# EAGLE design Flashing 2 LEDS (EAGLE 9.6.2)
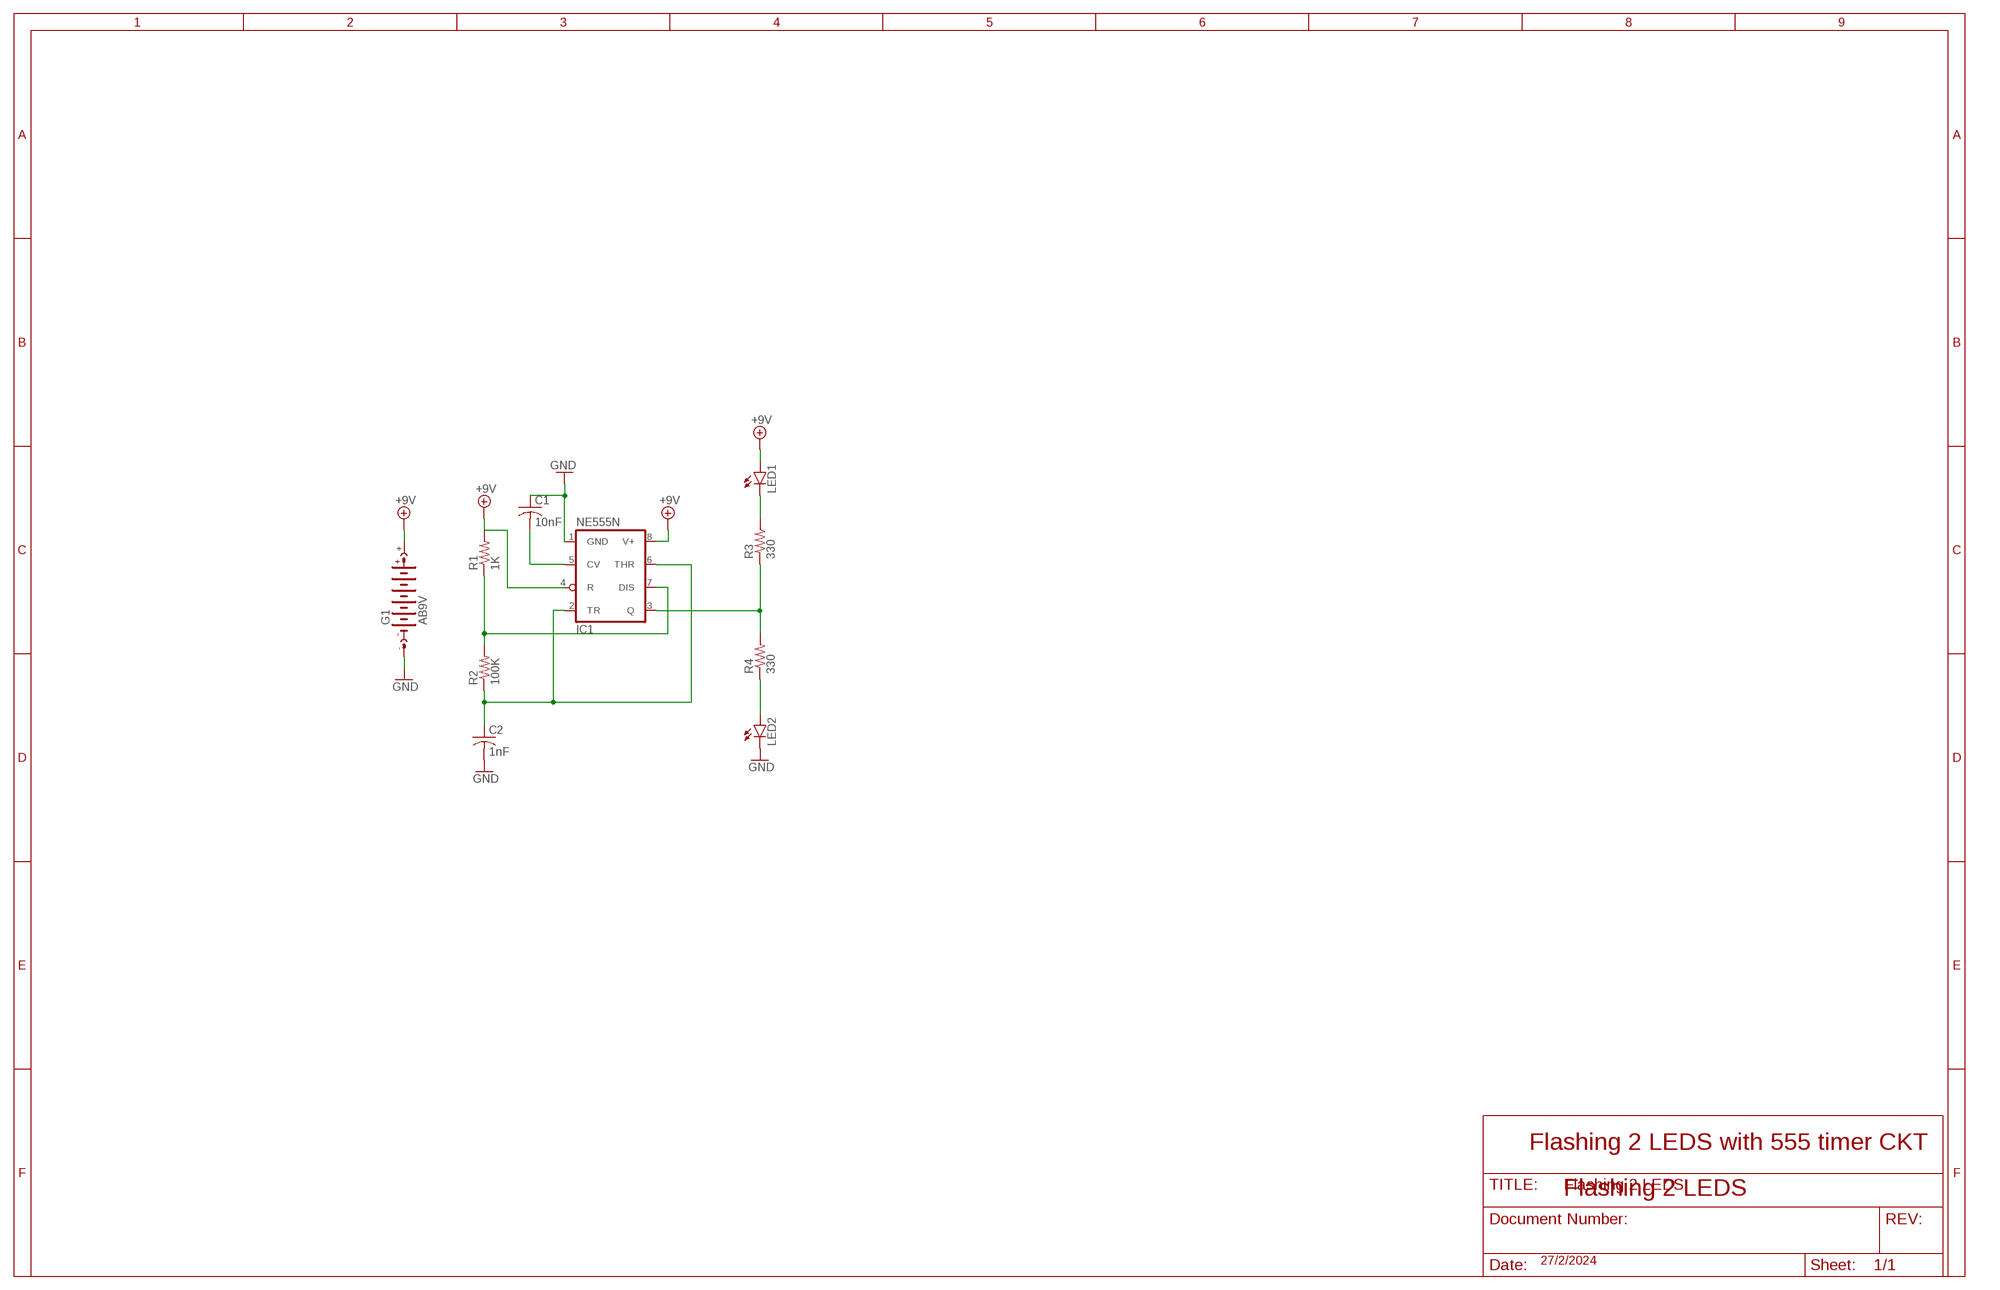
[diagram p0: schematic, sheet 1]

## Parts
C1  10nF  C-USC1206  [C1206]
C2  1nF  C-USC1206  [C1206]
G1  AB9V  [AB9V]
IC1  NE555N  [DIL08]
LED1  LED5MM  [LED5MM]
LED2  LED5MM  [LED5MM]
R1  1K  R-US_R0603  [R0603]
R2  100K  R-US_R0603  [R0603]
R3  330  R-US_R0603  [R0603]
R4  330  R-US_R0603  [R0603]

## Nets
+9V: G1.+ IC1.4(R) IC1.8(V+) LED1.A R1.2
GND: C1.1 C2.2 G1.- IC1.1(GND) LED2.K(C)
N$1: IC1.7(DIS) R1.1 R2.2
N$2: C2.1 IC1.2(TR) IC1.6(THR) R2.1
N$3: LED1.K(C) R3.2
N$4: IC1.3(Q) R3.1 R4.2
N$5: LED2.A R4.1
N$6: C1.2 IC1.5(CV)

## Notes on the sheet
- Flashing 2 LEDS with 555 timer CKT
- Flashing 2 LEDS
- 27/2/2024

## Library data of the parts
C1 C2 = rcl:C-US: CAPACITOR, American symbol; SPICEPREFIX: C
G1 = battery:AB9V: 9-V BATTERY CLIP
IC1 = linear:*555: TIMER
LED1 LED2 = led:LED: LED OSRAM: - CHIPLED LG R971, LG N971, LY N971, LG Q971, LY Q971, LO R971, LY R971 LH N974, LH R974 LS Q976, LO Q976, LY Q976 LO Q996 - Hyper CHIPLED LW Q18S LB Q993, LB Q99A, LB R99A - SideLED LS A670, LO A670, LY A670, LG A670, LP A670 LB A673, LV A673, LT A673, LW A673 LH A674 LY A675 LS A676, LA A676, LO A676, LY A676, LW A676 LS A679, LY A679, LG A679 - Hyper Micro SIDELED® LS Y876, LA Y876, LO Y876, LY Y876 LT Y87S - SmartLED LW L88C, LW L88S LB L89C, LB L89S, LG L890 LS L89K, LO L89K, LY L89K LS L896, LA L896, LO L896, LY L896 - TOPLED LS T670, LO T670, LY T670, LG T670, LP T670 LSG T670, LSP T670, LSY T670, LOP T670, LYG T670 LG T671, LOG T671, LSG T671 LB T673, LV T673, LT T673, LW T673 LH T674 LS T676, LA T676, LO T676, LY T676, LB T676, LH T676, LSB T676, LW T676 LB T67C, LV T67C, LT T67C, LS T67K, LO T67K, LY T67K, LW E67C LS E67B, LA E67B, LO E67B, LY E67B, LB E67C, LV E67C, LT E67C LW T67C LS T679, LY T679, LG T679 LS T770, LO T770, LY T770, LG T770, LP T770 LB T773, LV T773, LT T773, LW T773 LH T774 LS E675, LA E675, LY E675, LS T675 LS T776, LA T776, LO T776, LY T776, LB T776 LHGB T686 LT T68C, LB T68C - Hyper Mini TOPLED® LB M676 - Mini TOPLED Santana® LG M470 LS M47K, LO M47K, LY M47K Source: http://www.osram.convergy.de LUXEON: - LUMILED® LXK2-PW12-R00, LXK2-PW12-S00, LXK2-PW14-U00, LXK2-PW14-V00 LXK2-PM12-R00, LXK2-PM12-S00, LXK2-PM14-U00 LXK2-PE12-Q00, LXK2-PE12-R00, LXK2-PE12-S00, LXK2-PE14-T00, LXK2-PE14-U00 LXK2-PB12-K00, LXK2-PB12-L00, LXK2-PB12-M00, LXK2-PB14-N00, LXK2-PB14-P00, LXK2-PB14-Q00 LXK2-PR12-L00, LXK2-PR12-M00, LXK2-PR14-Q00, LXK2-PR14-R00 LXK2-PD12-Q00, LXK2-PD12-R00, LXK2-PD12-S00 LXK2-PH12-R00, LXK2-PH12-S00 LXK2-PL12-P00, LXK2-PL12-Q00, LXK2-PL12-R00 Source: www.luxeon.com KINGBRIGHT: KA-3528ASYC Source: www.kingbright.com
R1-R4 = rcl:R-US_: RESISTOR, American symbol; SPICEPREFIX: R

## Board
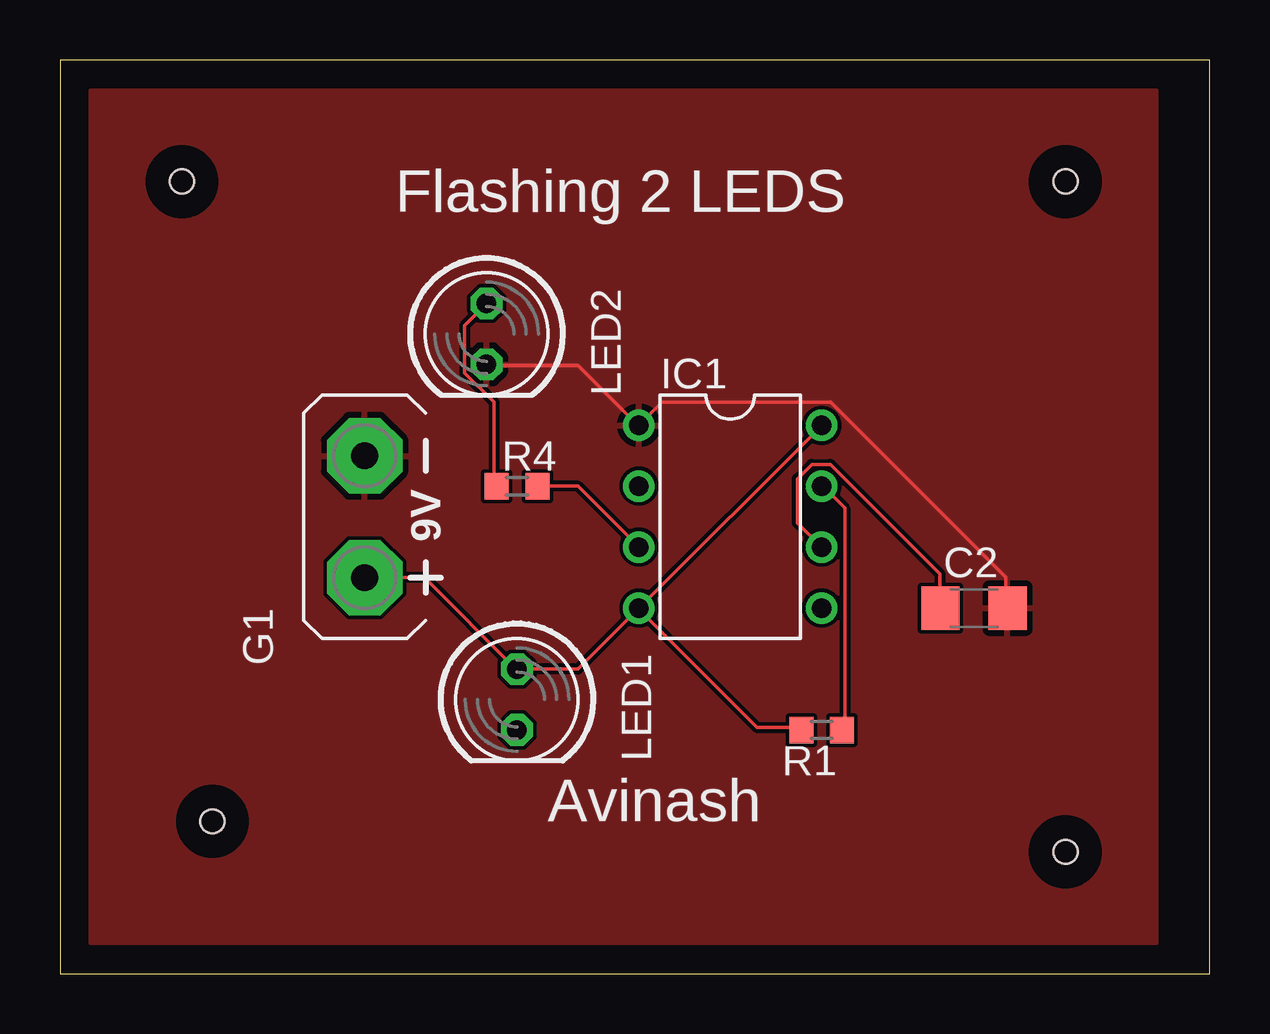
[diagram p1: board, top side]
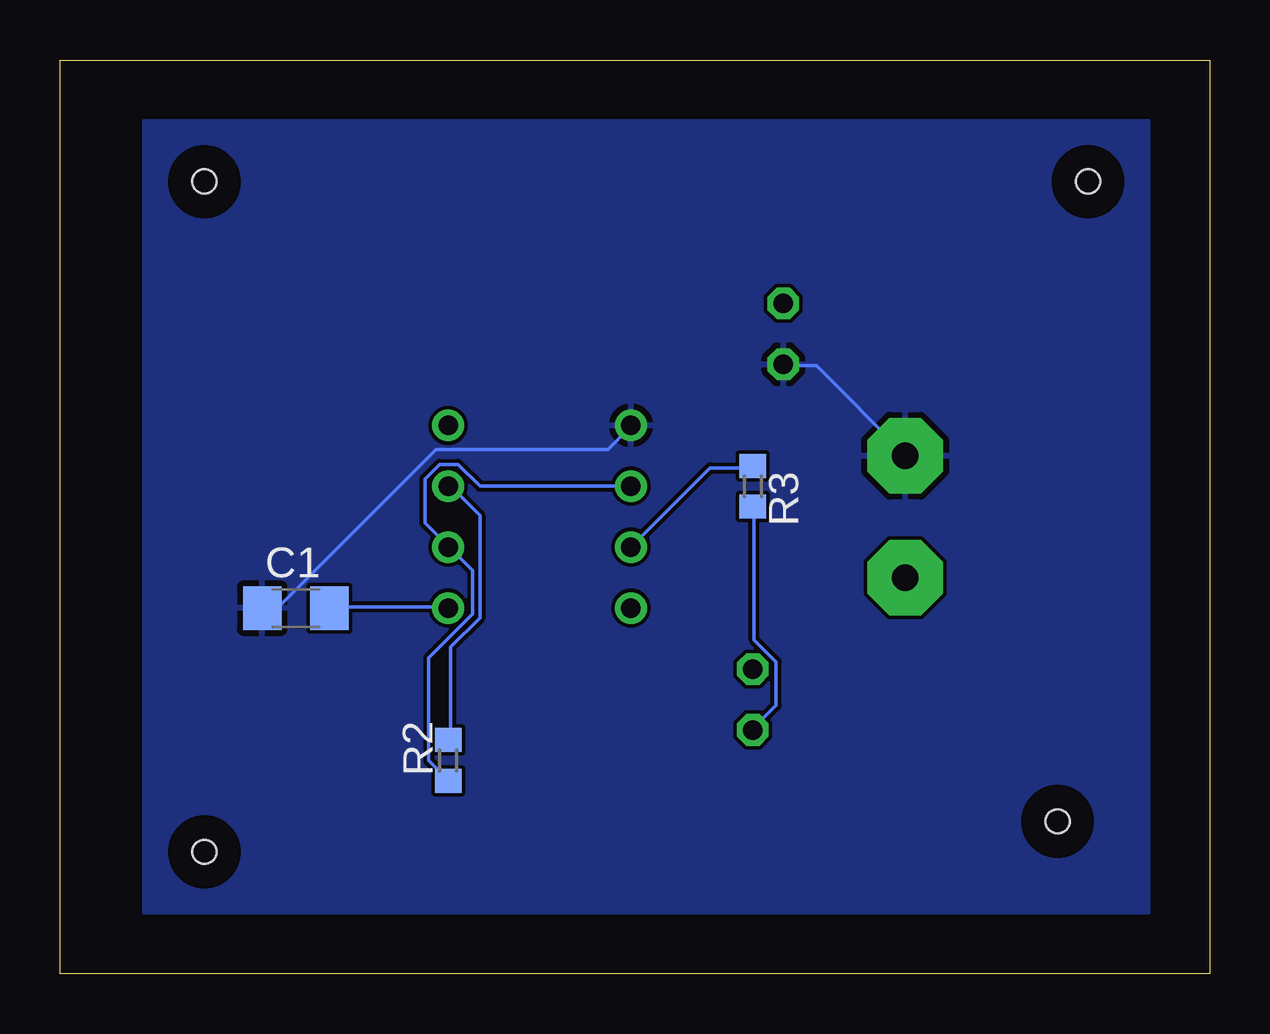
[diagram p2: board, bottom side, seen from below]

Size 47.93 x 38.09 mm. Coordinates in mm from the lower left corner, seen from the top.
Outline: 0,0 47.93,0 47.93,38.09 0,38.09 0,0
Copper layers (1*16): Top 0.035mm / dielectric 1.5mm / Bottom 0.035mm
Design rules "default": minimum track width 6mil, minimum drill 0.35mm, track to track 6mil, track to pad 6mil, pad to pad 6mil, via to via 6mil, smd to smd 6mil, copper to edge 40mil, drill to drill 6mil, minimum pad ring 10mil, minimum via ring 8mil, stop-mask expansion 4mil, vias tented up to drill 0mil, thermal gap 10mil
Holes 1 mm at 5.08,33.02 6.35,6.35 41.91,5.08 41.91,33.02

### Footprints (pad centres in the part's own frame; a part is rotated, then mirrored left to right if it is on the bottom)
C1206 = smd 1.6 x 1.8: 1 -1.4,0; 2 1.4,0
AB9V = drill 1.118 pad 3.15 octagon: + 0,2.54; - 0,-2.54
DIL08 = drill 0.813 pad 1.27: 1 -3.81,-3.81; 2 -1.27,-3.81; 3 1.27,-3.81; 4 3.81,-3.81; 5 3.81,3.81; 6 1.27,3.81; 7 -1.27,3.81; 8 -3.81,3.81
LED5MM = drill 0.813 octagon: A -1.27,0; K 1.27,0
R0603 = smd 1 x 1.1: 1 -0.85,0; 2 0.85,0

### Placement (x,y rotation side)
C1  38.1,15.24 0 bottom
C2  38.1,15.24 0 top
G1  12.7,19.05 180 top
IC1  27.94,19.05 270 top
LED1  19.05,11.43 270 top
LED2  17.78,26.67 270 top
R1  31.75,10.16 180 top
R2  31.75,8.89 90 bottom
R3  19.05,20.32 270 bottom
R4  19.05,20.32 0 top

### Tracks (layer width: path | path; a pad name or v marks a point on that pad's centre or on a via)
+9V
  Top 0.152: R1.2 30.89,10.26 29.06,10.26 24.18,15.14 IC1.4 | IC1.4 21.59,12.7 LED1.A 19,12.7 15.19,16.51 G1.+ | IC1.4 IC1.8
GND
  Top 0.152: C1.1 39.42,15.29 39.42,16.51 32.11,23.82 25.09,23.82 IC1.1 24.03,22.91 21.59,25.35 17.78,25.35 LED2.K
  Bottom 0.152: LED2.K 17.78,25.35 16.41,25.35 12.75,21.69 G1.- | C1.1 39.42,15.29 38.81,15.29 32.26,21.84 25.09,21.84 24.18,22.76 IC1.1
  pour Top: 1.27,36.83 45.72,36.83 45.72,1.27 1.27,1.27
  pour Bottom: 2.54,35.56 44.45,35.56 44.45,3.81 44.45,2.54 2.54,2.54
N$1
  Top 0.152: R1.1 32.71,10.26 32.71,19.41 31.8,20.32 IC1.7
  Bottom 0.152: R2.2 31.65,9.8 31.65,13.61 30.43,14.83 30.43,19.1 31.65,20.32 IC1.7
N$2
  Top 0.152: IC1.6 30.73,18.8 30.73,20.62 31.34,21.23 32.11,21.23 36.68,16.66 36.68,15.29 C2.1
  Bottom 0.152: R2.1 31.8,8.13 32.56,8.89 32.56,13.16 30.73,14.99 30.73,16.82 31.65,17.73 IC1.6 31.8,17.88 32.71,18.8 32.71,20.62 32.11,21.23 31.34,21.23 30.43,20.32 IC1.2
N$3
  Bottom 0.152: R3.2 19,19.41 19,13.92 18.09,13 18.09,11.18 19,10.26 LED1.K
N$4
  Top 0.152: R4.2 21.59,20.32 IC1.3
  Bottom 0.152: IC1.3 20.83,21.08 19.15,21.08 R3.1
N$5
  Top 0.152: LED2.A 16.87,27.03 16.87,25.04 18.09,23.82 18.09,20.32 R4.1
N$6
  Bottom 0.152: C1.2 36.68,15.29 31.8,15.29 IC1.5

### Text on the board
tNames: Flashing 2 LEDS | Avinash